# Altium project Programmable Power Supply.PrjPcb (part 1 of 2)
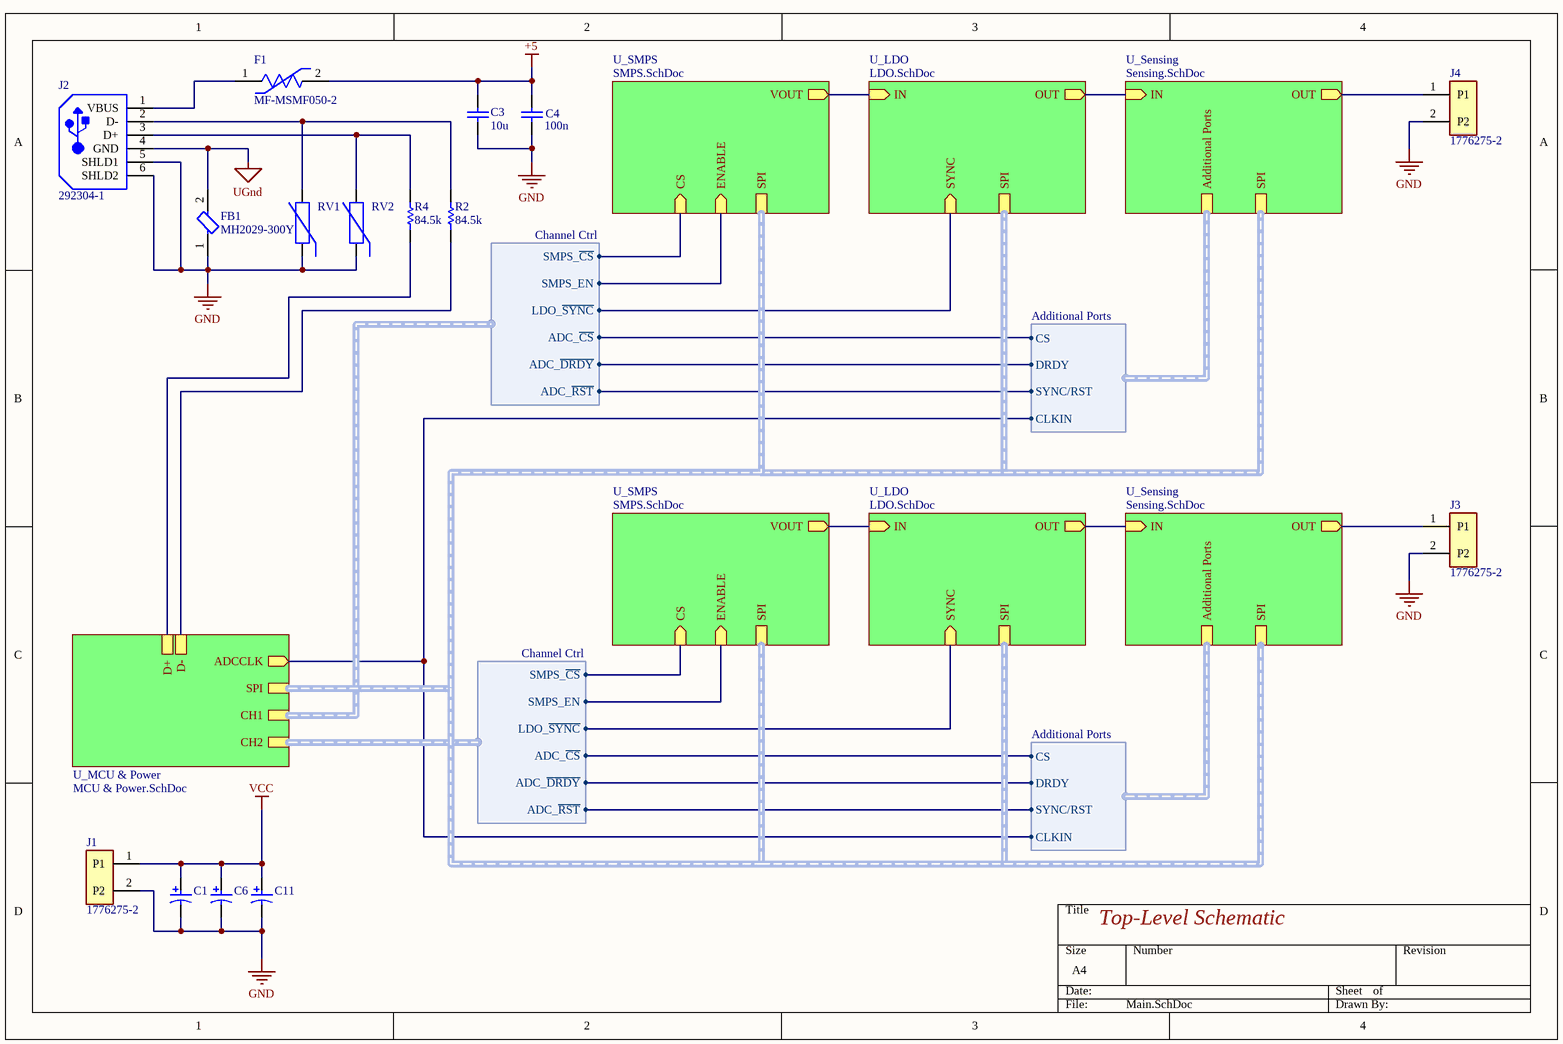
[diagram p0: Main.SchDoc]
5 sheets, 166 parts. Net scope: hierarchical (ports join the sheet entries above them; power ports are global).
Board file: PPS PCB.PcbDoc
Sheets:
  Main.SchDoc
    U_MCU & Power = MCU & Power.SchDoc
    U_SMPS = SMPS.SchDoc
    U_LDO = LDO.SchDoc
    U_Sensing = Sensing.SchDoc
    U_SMPS = SMPS.SchDoc
    U_LDO = LDO.SchDoc
    U_Sensing = Sensing.SchDoc

## Sheet Main.SchDoc
size A4; SheetNumber: 1; SheetTotal: 5

### Parts
C1  ECA-1JHG471  [CAPPR65-500-2000X1250X2200]  (value not drawn)
C3  10u  [CAPC3216X180X55LL20T30]
C4  100n  [CAPC2013X145X50LL20T25]
C6  ECA-1JHG471  [CAPPR65-500-2000X1250X2200]  (value not drawn)
C11  ECA-1JHG471  [CAPPR65-500-2000X1250X2200]  (value not drawn)
F1  MF-MSMF050-2  [FP-MF-MSMF050-2-MFG]
FB1  MH2029-300Y  [FP-MH2029-MFG]
J1  1776275-2  [TE_1776275-2]
J2  292304-1  [TECO-292304-1-4_V]
J3  1776275-2  [TE_1776275-2]
J4  1776275-2  [TE_1776275-2]
R2  84.5k  [RESC2013X60X35NL10T20]
R4  84.5k  [RESC2013X60X35NL10T20]
RV1  CG0603MLC-05E  [BOUR-CG0603-2_V]  (value not drawn)
RV2  CG0603MLC-05E  [BOUR-CG0603-2_V]  (value not drawn)

### Sub-sheets
U_LDO = LDO.SchDoc: IN (in), OUT (out), SPI (harness SPI Common), SYNC (in)
U_LDO = LDO.SchDoc: IN (in), OUT (out), SPI (harness SPI Common), SYNC (in)
U_MCU & Power = MCU & Power.SchDoc: ADCCLK (out), CH1 (harness Channel Ctrl), CH2 (harness Channel Ctrl), SPI (harness SPI Common), D-, D+
U_Sensing = Sensing.SchDoc: IN (in), OUT (out), Additional Ports (harness Additional Ports), SPI (harness SPI Common)
U_Sensing = Sensing.SchDoc: IN (in), OUT (out), Additional Ports (harness Additional Ports), SPI (harness SPI Common)
U_SMPS = SMPS.SchDoc: CS (in), ENABLE (in), VOUT (out), SPI (harness SPI Common)
U_SMPS = SMPS.SchDoc: CS (in), ENABLE (in), VOUT (out), SPI (harness SPI Common)

### Harnesses
Channel Ctrl: ADC_~{CS}, ADC_~{DRDY}, ADC_~{RST}, SMPS_~{CS}, SMPS_EN, LDO_~{SYNC}
Additional Ports: CLKIN, CS, DRDY, SYNC/RST

### Nets
+5: C3.2 C4.2 F1.2
GND: C1.2 C3.1 C4.1 C6.2 C11.2 FB1.1 J1.2(P2) J2.5(SHLD1) J2.6(SHLD2) J3.2(P2) J4.2(P2) RV1.1 RV2.1
UGnd: FB1.2 J2.4(GND)
VCC: C1.1 C6.1 C11.1 J1.1(P1)
NetC36_U_SMPS#1_2: sheet U_SMPS/VOUT, sheet U_LDO/IN
NetC36_U_SMPS#2_2: sheet U_SMPS/VOUT, sheet U_LDO/IN
NetC53_U_LDO#1_2: sheet U_LDO/OUT, sheet U_Sensing/IN
NetC53_U_LDO#2_2: sheet U_LDO/OUT, sheet U_Sensing/IN
NetF1_1: F1.1 J2.1(VBUS)
NetJ2_2: J2.2(D-) R2.2 RV1.2
NetJ2_3: J2.3(D+) R4.2 RV2.2
NetJ3_1: J3.1(P1) ; sheet U_Sensing/OUT
NetJ4_1: J4.1(P1) ; sheet U_Sensing/OUT
NetR2_1: R2.1 ; sheet U_MCU & Power/D-
NetR4_1: R4.1 ; sheet U_MCU & Power/D+
NetR16_U_SMPS#1_1: sheet U_SMPS/CS, sheet U_MCU & Power/CH1.SMPS_~{CS}
NetR16_U_SMPS#2_1: sheet U_SMPS/CS, sheet U_MCU & Power/CH2.SMPS_~{CS}
NetR21_U_SMPS#1_2: sheet U_SMPS/ENABLE, sheet U_MCU & Power/CH1.SMPS_EN
NetR21_U_SMPS#2_2: sheet U_SMPS/ENABLE, sheet U_MCU & Power/CH2.SMPS_EN
NetR24_U_LDO#1_1: sheet U_LDO/SYNC, sheet U_MCU & Power/CH1.LDO_~{SYNC}
NetR24_U_LDO#2_1: sheet U_LDO/SYNC, sheet U_MCU & Power/CH2.LDO_~{SYNC}
NetR29_U_Sensing#1_1: sheet U_MCU & Power/CH1.ADC_~{CS}, sheet U_Sensing/Additional Ports.CS
NetR29_U_Sensing#2_1: sheet U_MCU & Power/CH2.ADC_~{CS}, sheet U_Sensing/Additional Ports.CS
NetU1_26: sheet U_MCU & Power/CH1.ADC_~{RST}, sheet U_Sensing/Additional Ports.SYNC/RST
NetU1_27: sheet U_MCU & Power/CH1.ADC_~{DRDY}, sheet U_Sensing/Additional Ports.DRDY
NetU1_31: sheet U_MCU & Power/CH2.ADC_~{RST}, sheet U_Sensing/Additional Ports.SYNC/RST
NetU1_32: sheet U_MCU & Power/CH2.ADC_~{DRDY}, sheet U_Sensing/Additional Ports.DRDY
NetU2_2: sheet U_MCU & Power/ADCCLK, sheet U_Sensing/Additional Ports.CLKIN

### Buses and harness runs
harness sheet U_LDO/SPI = sheet U_MCU & Power/SPI = sheet U_Sensing/SPI = sheet U_SMPS/SPI

### Notes on the sheet
- Top-Level Schematic

### Library data of the parts
C1 C6 C11 = CMP-1665-00014-4: Aluminum Electrolytic Capacitor (Radial Lead Type), 470 uF, 63 V, -55 to 105 degC, 2-Pin THD, RoHS, Bulk; Manufacturer: Panasonic; Voltage Rating: 63 V; Lead Pitch: 5 mm; ComponentLink2URL: http://industrial.panasonic.com/cdbs/www-data/pdf/RDF0000/ABA0000C1038.pdf; DatasheetVersion: 03/2016; ComponentLink1URL: http://www.panasonic.com/; Mount: Through Hole; Max Operating Temperature: 105 degC; Pins: 2; Packaging: Bulk; ComponentLink1Description: Manufacturer URL; Height: 20 mm; REACH SVHC: No SVHC; RoHSCompliant: true; Mounting Technology: Through Hole; PackageDescription: 2-Pin Through Hole Device, Dia 12.5 mm, Body Length 20 mm; Package Quantity: 200; Min Operating Temperature: -55 degC; PackageReference: Radial; ComponentLink2Description: Datasheet; Length: 20 mm
C3 = CMP-2000-07261-1: High Value Multilayer Ceramic Capacitor, 10 uF, +/- 10%, 25 V, -55 to 125 degC, 1206 (3216 Metric), RoHS, Tape and Reel; Manufacturer: Taiyo Yuden; Catalog Drawings: xMKSeries_1206_1.6; Temperature Coefficient: X7R; Other Names: 587-2399-6; Capacitance: 10µF; Online Catalog: MSeries; Voltage - Rated: 25V; Package / Case: 1206(3216Metric); Thickness (Max): 0.071"(1.80mm); Tolerance: ±10%; Category: Capacitors; Size / Dimension: 0.126"Lx0.063"W(3.20mmx1.60mm); Lead Spacing: -; Standard Package: 1; Applications: GeneralPurpose; Features: -; Package Description: 2-Pin Surface Mount Device, Body 3.2 x 1.6 mm; Package Reference: 1206; Datasheet Version: 07/2015; Lead Style: -; Manufacturer URL: http://www.t-yuden.com/; Mounting Technology: SurfaceMount; Height - Seated (Max): -; Mounting Type: SurfaceMount,MLCC; Datasheet URL: http://datasheet.octopart.com/TMK316B7106KL-TD-Taiyo-Yuden-datasheet-62109620.pdf; Operating Temperature: -55°C~125°C; Series: M; Ratings: -; Packaging: Digi-Reel®; Family: CeramicCapacitors
C4 = CMP-2007-01136-1: Manufacturer: Kemet; Part Number: C0805C104K3RALTU
F1 = CMP-2100-03653-2: PTC RESET FUSE 15V 500MA 1812; Manufacturer: Bourns; Value: 0.15-1Ω; Trip Current: 1A; Automotive Grade: Grade 3; Trip Time: 0.15s; Current Rating: 100A; Hold Current: 0.5A; Height: 0.85mm; Package: 1812; Voltage Rating: 15V; Temperature Range High: +85°C; Device Class L2: PTC Resettable Fuses; Lead Free: Yes; ComponentLink2URL: http://www.bourns.com/docs/Product-Datasheets/mfmsmf.pdf; Ambient Temperature Range High: +85°C; Mouser Description: PTC Resettable Fuse 0.5A(hold) 1A(trip) 15V 100A 0.8W 0.15s 0.15Ohm SMD Solder Pad 1812 T/R; Digikey Description: PTC RESET FUSE 15V 500MA 1812; Manufacturer Part Number: MF-MSMF050-2; Resistance: 0.15-1Ω; Category: Fuse; ComponentLink2Description: Datasheet; Automotive: Yes; Temperature Range Low: -40°C; RoHS: TRUE; Device Class L1: Circuit Protection; Temperature: -40°C to +85°C; Octopart: https://octopart.com/mf-msmf050-2-bourns-28047; Ambient Temperature Range Low: -40°C; Device Class L3: unset
FB1 = CMP-07252-000001-1: FERRITE BEAD 30 OHM 0805 1LN; Manufacturer: Bourns; Series Resistance: 25mΩ; Resistance: 30Ω; Value: 30Ω; Impedance At Frequency: 30Ω @ 100MHz; Rms Current: 3A; Tolerance: 25%; RoHS: TRUE; Manufacturer Part Number: MH2029-300Y; Temperature Range High: +125°C; Device Class L3: Ferrite Beads and Chips; Core Material: Ferrite; ComponentLink2Description: Datasheet; Category: FBead; Octopart: https://octopart.com/mh2029-300y-bourns-756929; Digikey Description: FERRITE BEAD 30 OHM 0805 1LN; Device Class L2: EMI / RFI Components; Lead Free: Yes; Mouser Description: Ferrite Beads 30 ohms 25% HIGH CURRENT; Automotive: No; Ipc Land Pattern Name: CAPC200120X90; Temperature: -55°C to +125°C; Device Class L1: Passive Components; Height: 1.1mm; ComponentLink2URL: https://www.bourns.com/docs/Product-Datasheets/mh.pdf; Package: MH2029; Temperature Range Low: -55°C
J1 J3 J4 = 1776275-2: TERM BLOCK 2POS SIDE ENT 3.5MM; MF: {'manufacturer': u'TE Connectivity'}; Availability: Unavailable; Package: None; Price: None; Value: *; MP: 1776275-2
J2 = CMP-2000-05412-1: 1 Port Right Angle Through Hole Mount Female Type B USB Connector, 4 Position, -55 to 85 degC, RoHS, Tray; Manufacturer: TE Connectivity; USB Connector Type: USBTypeB; Gender: Receptacle; USB Standard: USB2.0; SVHC: ToBeAdvised; No. of Positions: 4; Series: B; Contact Plating: Gold; Orientation: RightAngle; Contact Material: CopperAlloy; Datasheet URL: https://datasheet.ciiva.com/851/eng-cd-292304-d2-851088.pdf; Connector Mounting: ThroughHole; Manufacturer URL: http://www.te.com/; Datasheet Version: Oct-93
R2 R4 = CMP-2001-01285-1: Manufacturer: Yageo; Part Number: RC0805FR-0784K5L
RV1 RV2 = CMP-0584-00001-2: ESD Protector, 5 V Supply, -40 to 85 degC, 1.6 x 0.8 x 0.55 mm SMD, RoHS, Tape and Reel; Manufacturer: Bourns; VC: 20 V; VT: 150 V; RT: 1 ns; VDC: 5 V; CO: 0.5 pF; PartNumber: CG0603MLC-05E; ComponentLink1Description: Manufacturer URL; ComponentLink1URL: http://www.bourns.com/; Packing: Tape and Reel; Mounting Technology: Surface Mount; ComponentLink2Description: Datasheet; RoHS: TRUE; Operating Temperature: -40 to 85 degC; DatasheetVersion: Rev. S; PackageDescription: 2-Pin SMD, Body 1.6 x 0.8 mm, Pitch 1.52 mm; PackageReference: CG0603-2; ComponentLink2URL: http://www.bourns.com/data/global/pdfs/MLC.pdf

## Sheet MCU & Power.SchDoc
size A4; SheetNumber: 5; SheetTotal: 5
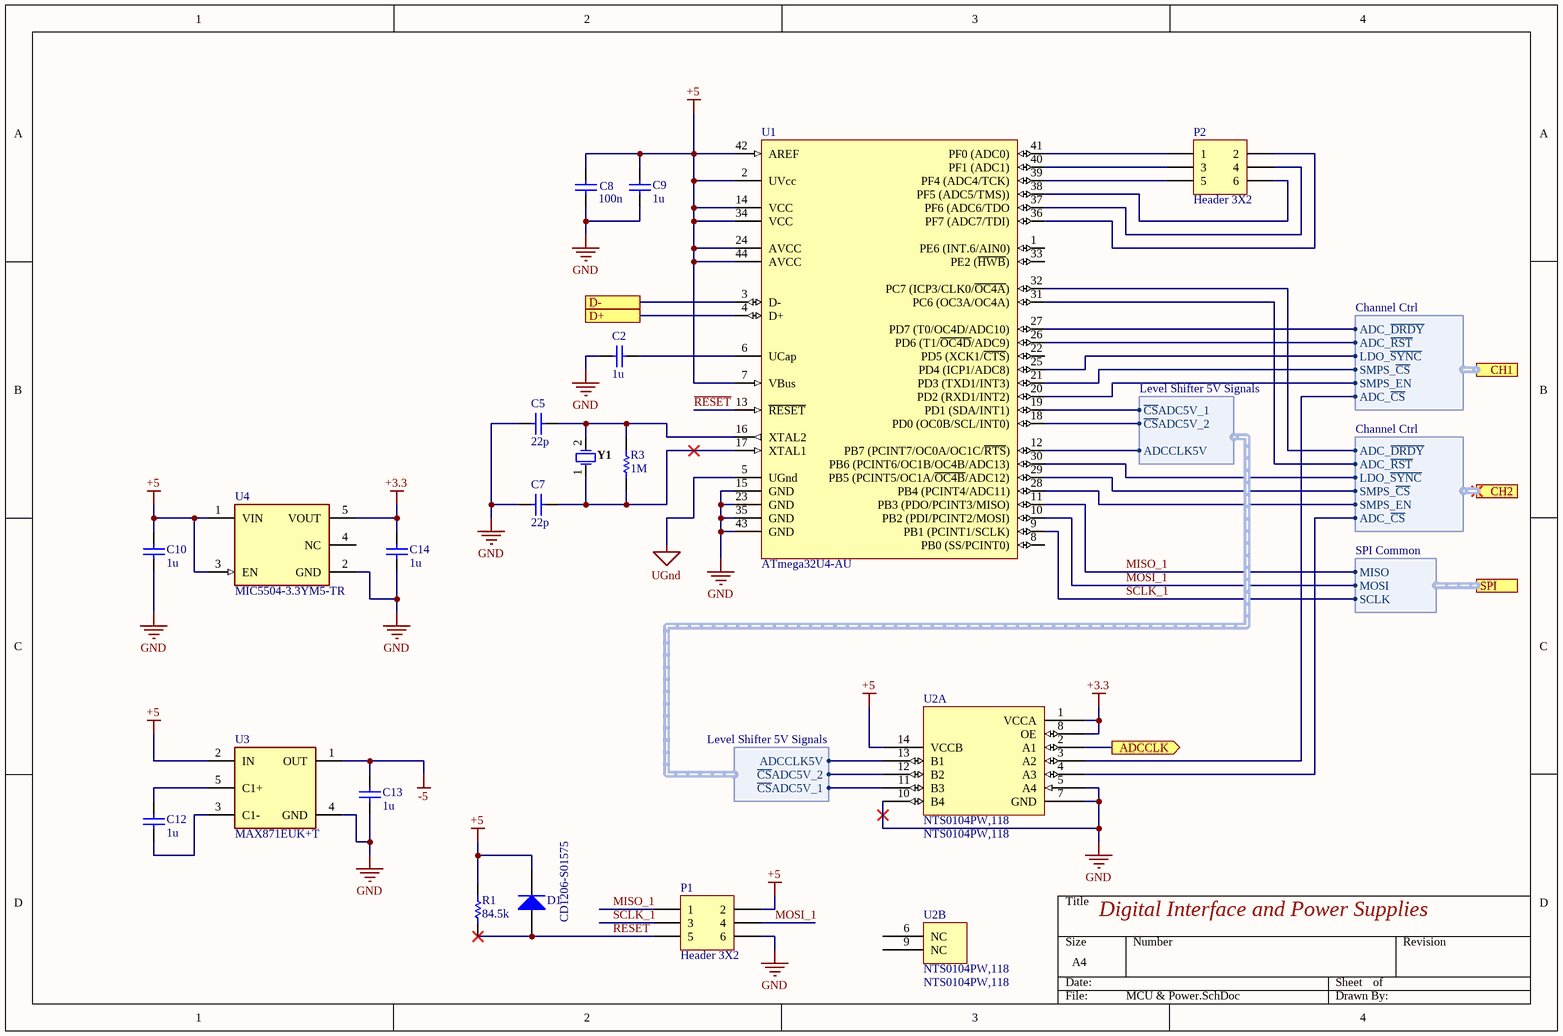
[diagram p1: MCU & Power.SchDoc]

### Parts
C2  1u  [CAPC2013X140X50LL20T25]
C5  22p  [CAPC2013X140X50NL20T25]
C7  22p  [CAPC2013X140X50NL20T25]
C8  100n  [CAPC2013X145X50LL20T25]
C9  1u  [CAPC2013X140X50LL20T25]
C10  1u  [CAPC2013X140X50LL20T25]
C12  1u  [CAPC2013X140X50LL20T25]
C13  1u  [CAPC2013X140X50LL20T25]
C14  1u  [CAPC2013X140X50LL20T25]
D1  CD1206-S01575  [BOUR-CD1206-S01575-2_N]
P1  Header 3X2  [HDR2X3]
P2  Header 3X2  [HDR2X3]
R1  84.5k  [RESC2013X60X35NL10T20]
R3  1M  [RESC2013X70X40NL20T20]
U1  ATmega32U4-AU  [44ML_M]
U2  NTS0104PW,118  [TSOP65P640X110-14N]  (parts A,B of 2)
U3  MAX871EUK+T  [FP-U5-2-MFG]
U4  MIC5504-3.3YM5-TR  [FP-SOT23-5LD-PL-1-MFG]
Y1  FOXSLF/160-20  [FOX-FOXSLF160-20]  (value not drawn)

### Ports
ADCCLK (out), CH1 (harness Channel Ctrl), CH2 (harness Channel Ctrl), D+, D-, SPI (harness SPI Common)

### Harnesses
Level Shifter 5V Signals: ~{CS}ADC5V_1, ~{CS}ADC5V_2, ADCCLK5V
Level Shifter 5V Signals: ADCCLK5V, ~{CS}ADC5V_1, ~{CS}ADC5V_2
Channel Ctrl: ADC_~{CS}, SMPS_EN, SMPS_~{CS}, LDO_~{SYNC}, ADC_~{RST}, ADC_~{DRDY}
SPI Common: MISO, MOSI, SCLK

### Nets
+3.3: C14.2 U2.1(VCCA) U2.8(OE) U4.5(VOUT)
+5: C8.2 C9.2 C10.2 D1.2(K) P1.2 R1.2 U1.2(UVcc) U1.7(VBus) U1.14(VCC) U1.24(AVCC) U1.34(VCC) U1.42(AREF) U1.44(AVCC) U2.14(VCCB) U3.2(IN) U4.1(VIN) U4.3(EN)
-5: C13.2 U3.1(OUT)
GND: C2.2 C5.1 C7.1 C8.1 C9.1 C10.1 C13.1 C14.1 P1.6 U1.15(GND) U1.23(GND) U1.35(GND) U1.43(GND) U2.5(A4) U2.7(GND) U2.10(B4) U3.4(GND) U4.2(GND)
UGnd: U1.5(UGnd)
MISO_1: P1.1 U1.11(PB3_(PDO/PCINT3/MISO)) ; port SPI.MISO
MOSI_1: P1.4 U1.10(PB2_(PDI/PCINT2/MOSI)) ; port SPI.MOSI
~{RESET}: D1.1(A) P1.5 R1.1 U1.13(~{RESET})
SCLK_1: P1.3 U1.9(PB1_(PCINT1/SCLK)) ; port SPI.SCLK
NetC2_1: C2.1 U1.6(UCap)
NetC5_2: C5.2 R3.2 U1.16(XTAL2) Y1.2
NetC7_2: C7.2 R3.1 U1.17(XTAL1) Y1.1
NetC12_1: C12.1 U3.3(C1-)
NetC12_2: C12.2 U3.5(C1+)
NetP2_1: P2.1 U1.41(PF0_(ADC0))
NetP2_2: P2.2 U1.36(PF7_(ADC7/TDI))
NetP2_3: P2.3 U1.40(PF1_(ADC1))
NetP2_4: P2.4 U1.37(PF6_(ADC6/TDO)
NetP2_5: P2.5 U1.39(PF4_(ADC4/TCK))
NetP2_6: P2.6 U1.38(PF5_(ADC5/TMS)))
NetR2_1: U1.3(D-) ; port D-
NetR4_1: U1.4(D+) ; port D+
NetR16_U_SMPS#1_1: U1.21(PD3_(TXD1/INT3)) ; port CH1.SMPS_~{CS}
NetR16_U_SMPS#2_1: U1.29(PB5_(PCINT5/OC1A/~{OC4B}/ADC12)) ; port CH2.SMPS_~{CS}
NetR21_U_SMPS#1_2: U1.20(PD2_(RXD1/INT2)) ; port CH1.SMPS_EN
NetR21_U_SMPS#2_2: U1.28(PB4_(PCINT4/ADC11)) ; port CH2.SMPS_EN
NetR24_U_LDO#1_1: U1.25(PD4_(ICP1/ADC8)) ; port CH1.LDO_~{SYNC}
NetR24_U_LDO#2_1: U1.30(PB6_(PCINT6/OC1B/OC4B/ADC13)) ; port CH2.LDO_~{SYNC}
NetR29_U_Sensing#1_1: U2.3(A2) ; port CH1.ADC_~{CS}
NetR29_U_Sensing#2_1: U2.4(A3) ; port CH2.ADC_~{CS}
NetU1_12: U1.12(PB7_(PCINT7/OC0A/OC1C/~{RTS})) U2.13(B1) ; harness Level Shifter 5V Signals.ADCCLK5V
NetU1_18: U1.18(PD0_(OC0B/SCL/INT0)) U2.12(B2) ; harness Level Shifter 5V Signals.~{CS}ADC5V_2
NetU1_19: U1.19(PD1_(SDA/INT1)) U2.11(B3) ; harness Level Shifter 5V Signals.~{CS}ADC5V_1
NetU1_26: U1.26(PD6_(T1/~{OC4D}/ADC9)) ; port CH1.ADC_~{RST}
NetU1_27: U1.27(PD7_(T0/OC4D/ADC10)) ; port CH1.ADC_~{DRDY}
NetU1_31: U1.31(PC6_(OC3A/OC4A)) ; port CH2.ADC_~{RST}
NetU1_32: U1.32(PC7_(ICP3/CLK0/~{OC4A})) ; port CH2.ADC_~{DRDY}
NetU2_2: U2.2(A1) ; port ADCCLK

Not connected (* = marked no-connect by the designer): U1 1(PE6_(INT.6/AIN0)) 8(PB0_(SS/PCINT0)) 22(PD5_(XCK1/~{CTS})) 33(PE2_(~{HWB})); U2 6(NC) 9(NC); U4 4(NC)

### Notes on the sheet
- Digital Interface and Power Supplies

### Library data of the parts
C2 C9 C10 C12-C14 = CMP-2007-03234-1: Part Number: C0805C105K3RACTU; Manufacturer: Kemet
C5 C7 = CMP-2007-04539-1: Part Number: 08051A220JAT2A; Manufacturer: AVX Interconnect / Elco
C8 = CMP-2007-01136-1: as C4 on sheet Main
D1 = CMP-0583-00001-2: 75 V Small Signal Switching Diode, 150 mA, 2.5 uA, 1026 Molded Package, RoHS, Tape and Reel; Manufacturer: Bourns; Reverse Voltage: 75 V; Average Forward Current: 150 mA; Reverse Current (Max.): 2.5 uA; Capacitance Between Terminals (Max.): 3 pF; Reverse Recovery Time (Max.): 4 nS; Forward Voltage (Max.): 1.00 V; Packing: Tape and Reel; Mounting Technology: Surface Mount; DatasheetVersion: Rev. 06/11; ComponentLink2URL: http://www.bourns.com/data/global/pdfs/CD1206_S01575.pdf; PackageReference: CD1206-S01575-2; RoHS: TRUE; ComponentLink1URL: http://www.bourns.com/; ComponentLink1Description: Manufacturer URL; ComponentLink3Description: Package Specification; ComponentLink3URL: http://www.bourns.com/data/global/pdfs/CD1206_S01575.pdf; ComponentLink2Description: Datasheet; PackageDescription: 2-Pin SMD, Body 3.2 x 1.5 mm; PartNumber: CD1206-S01575
P1 P2 = Header 3X2: Header, 3-Pin, Dual row; LatestRevisionDate: 17-Jul-2002; LatestRevisionNote: Re-released for DXP Platform.; Publisher: Altium Limited
R1 = CMP-2001-01285-1: as R2 on sheet Main
R3 = CMP-2001-00339-1: Part Number: ERJ-6GEYJ105V; Manufacturer: Panasonic
U1 = CMP-0095-00285-2: 8-bit AVR Microcontroller, 2.7-5.5V, 16MHz, 32KB Flash, 1KB EEPROM, 2.5KB SRAM, USB Controller, 44-pin TQFP, Industrial Grade (-40°C to 85°C), Ext Osc; RevisionNote: DatasheetVersion updated. URLs added.; ComponentLink1Description: Manufacturer URL; PackageDescription: 44-Pin Plastic Thin Quad Flat Pack, 10 x 10 x 1.0 mm Body, 0.8 mm Pitch (TQFP); DatasheetVersion: revF, Nov-2010; ComponentLink2URL: http://www.atmel.com/dyn/resources/prod_documents/doc7766.pdf; ComponentLink1URL: http://www.atmel.com/; PackageReference: 44ML; ComponentLink2Description: ATmega16U4/32U4 Datasheet; PackageVersion: rev.G, Jul-2007; ComponentLink3URL: http://www.atmel.com/dyn/resources/prod_documents/7766S.pdf; ComponentLink3Description: ATmega16U4 ATmega32U4 Summary
U2 = NTS0104PW,118: Voltage Level Translator 14-Pin TSSOP T/R; Manufacturer: NXP Semiconductors; Max Supply Voltage: 5.5V; Min Supply Voltage: 1.65V; High Level Output Current: -20uA; Low Level Output Current: 1mA; Quiescent Current: 45uA; Propagation Delay: 280ns; Data Rate: 50Mbps; Number of Channels: 4; Max Power Dissipation: 250mW; Turn-On Delay Time: 5.8ns; Number of Elements: 1; Polarity: Non-Inverting; Operating Frequency-Max: 10MHz; Supplier 1: Digi-Key; RoHS: Yes; Category: Voltage Level Shifters; Stock 1: 15992; Pricing 1: 1=0.89000, 10=0.79100, 25=0.75120, 100=0.72820 (USD); Mount: Surface Mount; Case/Package: TSSOP; Number of Pins: 14; Min Operating Temperature: -40°C; Max Operating Temperature: 125°C; Logic Function: Translator; Packaging: Tape and Reel; Package Quantity: 1; Number of Bits: 4; Output Type: Voltage; Series: -; Radiation Hardening: No; RoHS Compliant: Yes; Lead Free: Lead Free; ComponentLink1URL: https://datasheet.ciiva.com/15096/getdatasheetpartid-507519-15096327.pdf?src-supplier=Verical; ComponentLink1Description: https://datasheet.ciiva.com/15096/getdatasheetpartid-507519-15096327.pdf?src-supplier=Verical; ComponentLink2URL: https://datasheet.ciiva.com/1899/nts0104-1899064.pdf?src-supplier=Digi-Key; ComponentLink2Description: https://datasheet.ciiva.com/1899/nts0104-1899064.pdf?src-supplier=Digi-Key; ComponentLink3URL: https://datasheet.ciiva.com/1899/nts0104-1899065.pdf?src-supplier=Digi-Key; ComponentLink3Description: https://datasheet.ciiva.com/1899/nts0104-1899065.pdf?src-supplier=Digi-Key; ComponentLink4URL: https://datasheet.ciiva.com/1899/nts0104-1899066.pdf?src-supplier=Digi-Key; ComponentLink4Description: https://datasheet.ciiva.com/1899/nts0104-1899066.pdf?src-supplier=Digi-Key; ComponentLink5URL: https://datasheet.ciiva.com/8244/nts0104-8244175.pdf?src-supplier=Avnet; ComponentLink5Description: https://datasheet.ciiva.com/8244/nts0104-8244175.pdf?src-supplier=Avnet; Manufacturer Part Number: NTS0104PW,118
U3 = CMP-05722-000155-1: IC REG CHRG PUMP LCD 1OUT SOT23; Manufacturer: Maxim; Nominal Supply Current: 2.7mA; Number Of Outputs: 1; Min Supply Voltage: 1V; Switching Frequency: 500kHz; Max Supply Voltage: 5.5V; Max Power Dissipation: 571mW; Switching Topology: Charge Pump; Output Type: Fixed; Negative Voltage Available: true; Standoff Height: 0mm; Output Voltage: -5.5V; Output Current: 25mA; Temperature: -40°C to +85°C; Lead Free: Yes; Footprint Url: https://pdfserv.maximintegrated.com/land_patterns/90-0174.PDF; Digikey Description: IC REG CHRG PUMP LCD 1OUT SOT23; Octopart: https://octopart.com/max871euk%2Bt-maxim+integrated-39868455; Device Class L1: Integrated Circuits (ICs); Automotive: No; ComponentLink2Description: Datasheet; Device Class L2: Power Management ICs; Category: IC; Temperature Range Low: -40°C; RoHS: TRUE; ComponentLink2URL: https://datasheets.maximintegrated.com/en/ds/MAX870-MAX871.pdf; Temperature Range High: +85°C; Height: 1.45mm; Package: U5-2; Device Class L3: Voltage Regulators - Switching; Manufacturer Part Number: MAX871EUK+T
U4 = CMP-2000-07604-2: IC REG LINEAR 3.3V 300MA SOT23-5; Quiescent Current: 38uA; Operating Supply Current: 42uA; Max Input Voltage: 5.5V; Min Input Voltage: 2.5V; Output Type: Fixed; Power Supply Rejection Ratio (PSRR): 60dB; Dropout Voltage: 380mV; Accuracy: 3%; Number of Outputs: 1; Nominal Output Voltage: 3.3V; Max Output Current: 300mA; Length: 2.9mm; Mount: Surface Mount; Width: 1.6mm; Packaging: Tape and Reel; Output Current: 300mA; Min Operating Temperature: -40°C; Max Operating Temperature: 125°C; Height: 1.1mm; Case/Package: SOT-23-5; REACH SVHC: No SVHC; Number of Pins: 5; Output Voltage: 3.3V
Y1 = CMP-1749-00003-1: Resistance Weld Thru-Hole Crystal, 16 MHz, -20 to 70 degC, 2-Pin THD, RoHS, Bulk; Voltage Rating: 250 V; Tolerance: 1%; Resistance: 221 kohm; Case\Package: Axial; Power Rating: 250 mW; RoHSCompliant: true; Package Quantity: 200; Packaging: Bulk; Min Operating Temperature: -55 degC; DatasheetVersion: Mar-15; ComponentLink1URL: http://www.foxonline.com/; Max Operating Temperature: 155 degC; PackageReference: FOXSLF160-20; Mount: Through Hole; PackageDescription: 2-Pin Through Hole Device, Body 11.35 x 4.65 mm; ComponentLink1Description: Manufacturer URL; ComponentLink2URL: http://www.foxonline.com/pdfs/hc49slf.pdf; ComponentLink2Description: Datasheet; Length: 0.248 inch

## Sheet SMPS.SchDoc
size A4; SheetNumber: 2; SheetTotal: 5
Used 2 times, as channels U_SMPS, U_SMPS. Parts and nets are listed once, with the designators drawn on the sheet.
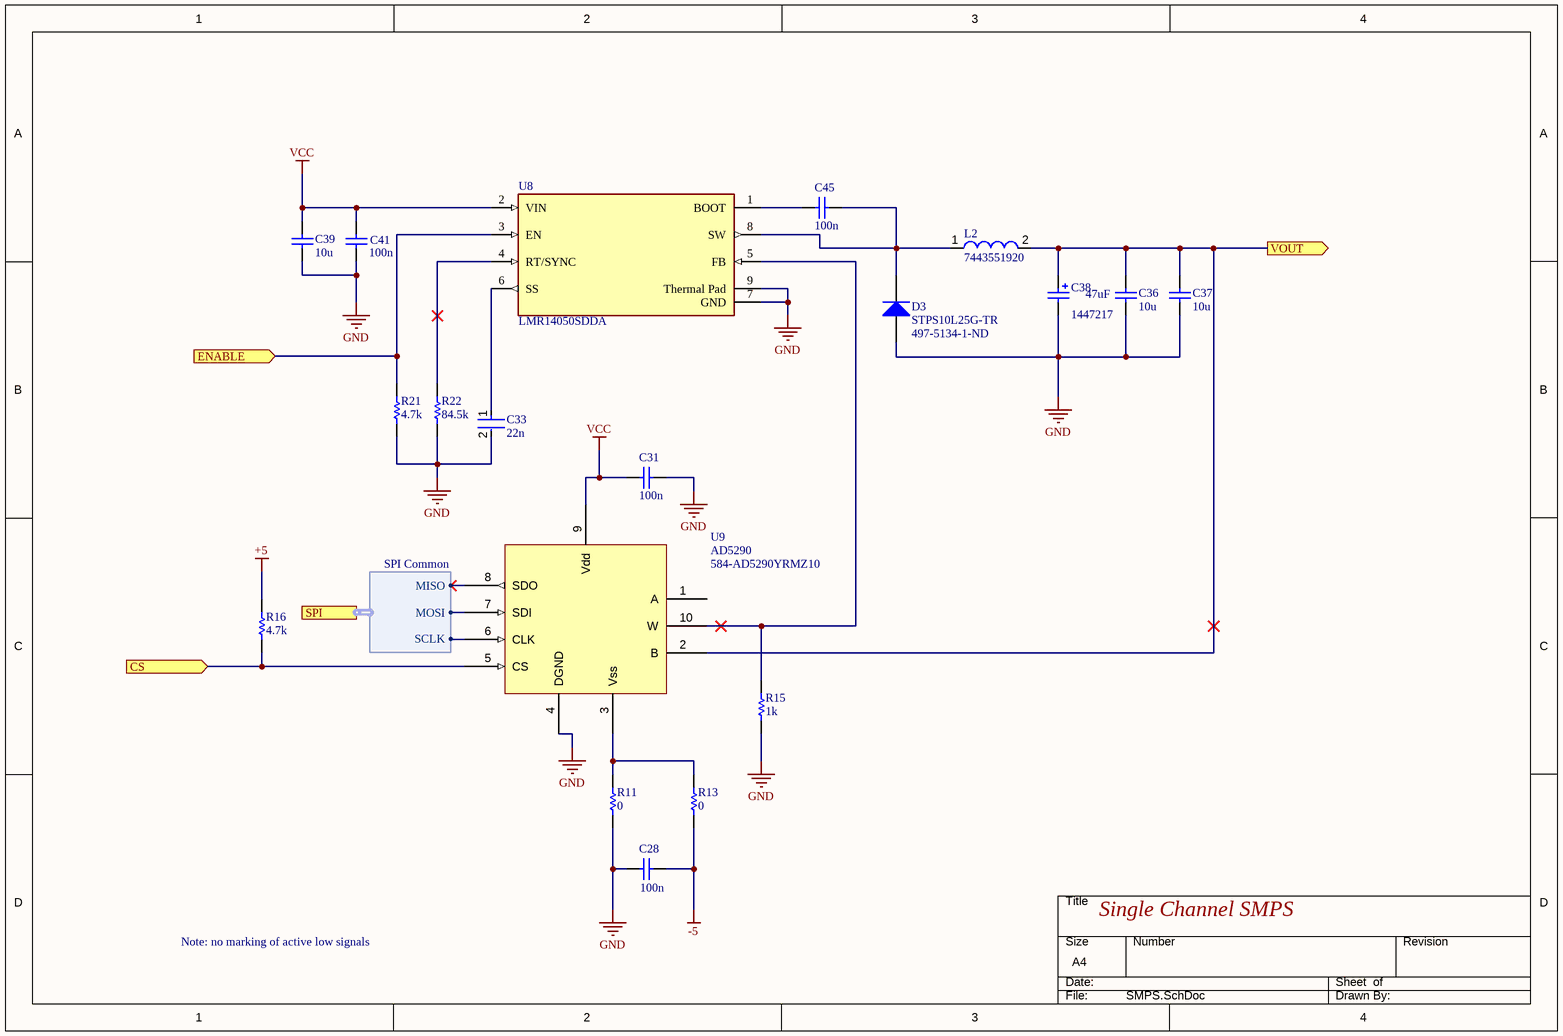
[diagram p2: SMPS.SchDoc]

### Parts
C28  100n  [CAPC2013X145X50LL20T25]
C31  100n  [CAPC2013X145X50NL20T25]
C33  22n  [FP-CC0805-0_85-MFG]
C36  10u  [CAPC3216X180X55LL20T30]
C37  10u  [CAPC3216X180X55LL20T30]
C38  Capacitance: 47uF  Supplier Part Number 1: 1447217  [7343]  (hidden comment: T521X476M035ATE030)
C39  10u  [CAPC3216X180X55LL20T30]
C41  100n  [CAPC2013X145X50LL20T25]
C45  100n  [CAPC2013X145X50LL20T25]
D3  STPS10L25G-TR  Supplier Part Number 1: 497-5134-1-ND  [D2PAK]
L2  7443551920  [WE-HCI-1365]
R11  0  [RESC2013X70X40NL20T20]
R13  0  [RESC2013X70X40NL20T20]
R15  1k  [RESC2013X50X30NL20T20]
R16  4.7k  [RESC2013X70X40ML20T20]
R21  4.7k  [RESC2013X70X40NL20T20]
R22  84.5k  [RESC2013X60X35NL10T20]
U8  LMR14050SDDA  [FP-DDA0008E-IPC_B]
U9  AD5290  Supplier Part Number 1: 584-AD5290YRMZ10  [MSOP10]

### Ports
CS (in), ENABLE (in), SPI (harness SPI Common), VOUT (out)

### Harnesses
SPI Common: MISO, MOSI, SCLK

### Nets
+5: R16.2
-5: C28.1 R13.1
GND: C28.2 C31.1 C33.2 C36.1 C37.1 C38.2 C39.1 C41.1 D3.1(A) R11.1 R15.1 R21.1 R22.1 U8.7(GND) U8.9(Thermal_Pad) U9.4(DGND)
VCC: C31.2 C39.2 C41.2 U8.2(VIN) U9.9(Vdd)
CS: R16.1 U9.5(CS) ; port CS
ENABLE: R21.2 U8.3(EN) ; port ENABLE
VOUT: C36.2 C37.2 C38.1 L2.2 U9.2(B) ; port VOUT
NetC33_1: C33.1 U8.6(SS)
NetC45_1: C45.1 D3.2(K) L2.1 U8.8(SW)
NetC45_2: C45.2 U8.1(BOOT)
NetR11_2: R11.2 R13.2 U9.3(Vss)
NetR15_2: R15.2 U8.5(FB) U9.10(W)
NetR22_2: R22.2 U8.4(RT/SYNC)
NetU9_6: U9.6(CLK) ; port SPI.SCLK
NetU9_7: U9.7(SDI) ; port SPI.MOSI
NetU9_8: U9.8(SDO) ; port SPI.MISO

Not connected (* = marked no-connect by the designer): U9 1(A)

### Channels
U_SMPS: designators end in _U_SMPS#1; ports CS=NetR16_U_SMPS#1_1 ENABLE=NetR21_U_SMPS#1_2 VOUT=NetC36_U_SMPS#1_2
U_SMPS: designators end in _U_SMPS#2; ports CS=NetR16_U_SMPS#2_1 ENABLE=NetR21_U_SMPS#2_2 VOUT=NetC36_U_SMPS#2_2

### Notes on the sheet
- Single Channel SMPS
- Note: no marking of active low signals
- THIS DOCUMENT AND THE DATA DISCLOSED HEREIN OR
- HEREWITH IS THE PROPERTY OF ALTIUM LIMITED AND MAY
- DWG NO:
- REVISION
- REV:
- DESCRIPTION
- DATE
- APPROVED
- BE FREELY DISTRIBUTED IN WHOLE. NO RIGHTS ARE
- RESERVED OR EXPRESS OR IMPLIED WARANTEE GIVEN.
- ENG:
- APPROVALS
- PROJECT
- DSN:
- CHK:
- REFERENCE DOCUMENTS
- PROJECT REVISION:
- TITLE
- DOCUMENT REVISION:
- DESIGN ITEM:
- BOM:
- FAB DWG:
- PCB DWG:
- ASSY DWG:
- SCALE:
- A3
- SIZE
- CAGE CODE
- FILE NAME
- DWG NO.
- SHEET
- OF
- REV

### Library data of the parts
C28 C31 C41 C45 = CMP-2007-01136-1: as C4 on sheet Main
C33 = CMP-1036-04052-2: CAP CER 0.022UF 25V X7R 0805; Manufacturer Part Number: CC0805KRX7R8BB223; Manufacturer: Yageo; Capacitance: 22 nF; Tolerance: 0.1; Material: Ceramic; Value: 22 nF; Automotive: No; ComponentLink2Description: Datasheet; Ipc Land Pattern Name: CAPC200125X85; Height: 0.95mm; Temperature Characteristic: X7R; Lead Free: Yes; Footprint Url: http://www.yageo.com/exep/pages/download/literatures/UPY-C_GEN_24.pdf; ComponentLink2URL: http://www.yageo.com/documents/recent/UPY-GPHC_Y5V_6.3V-to-50V_8.pdf; Octopart: https://octopart.com/cc0805krx7r8bb223-yageo-42522869; Category: Cap; Package: CC0805-0.85; Digikey Description: CAP CER 0.022UF 25V X7R 0805; Temperature Range High: +85°C; Temperature: -30°C to +85°C; Voltage Rating: 25 V; Device Class L3: Ceramic Capacitors; Device Class L1: Passive Components; Device Class L2: Capacitors; RoHS: TRUE; Mouser Description: Multilayer Ceramic Capacitors MLCC - SMD/SMT 22nF 25V X7R 10%; Temperature Range Low: -30°C
C36 C37 C39 = CMP-2000-07261-1: as C3 on sheet Main; Package / Case: 1206(3216Metric); Thickness (Max): 0.071"(1.80mm); Tolerance: ±10%; Category: Capacitors; Size / Dimension: 0.126"Lx0.063"W(3.20mmx1.60mm); Lead Spacing: -; Standard Package: 1; Applications: GeneralPurpose; Features: -; Package Description: 2-Pin Surface Mount Device, Body 3.2 x 1.6 mm; Package Reference: 1206; Datasheet Version: 07/2015; Lead Style: -; Manufacturer URL: http://www.t-yuden.com/; Mounting Technology: SurfaceMount; Height - Seated (Max): -; Mounting Type: SurfaceMount,MLCC; Datasheet URL: http://datasheet.octopart.com/TMK316B7106KL-TD-Taiyo-Yuden-datasheet-62109620.pdf; Operating Temperature: -55°C~125°C; Series: M; Ratings: -; Packaging: Digi-Reel®; Family: CeramicCapacitors
C38 = T521X476M035ATE030: KEMET - T521X476M035ATE030 - CAP, TANT, POLYMER, 47UF, 35V, CASE X; pin to pad: 1>2 2>1; Tolerance: 20%; ESR (Equivalent Series Resistance): 30mR; Polarity: Polar; Life (Hours): 2000Hour; Dissipation Factor: 10%; Supplier 1: RSComponents; Manufacturer: KEMET; Manufacturer Part Number: T521X476M035ATE030; RoHS: Yes; Category: Polymer Capacitors; Stock 1: 1; Pricing 1: 500=2.79100, 1500=2.59300 (USD); Mount: Surface Mount; Case/Package: 2917; Number of Pins: 2; Case Code (Imperial): 2917; Case Code (Metric): 7343; Min Operating Temperature: -55°C; Max Operating Temperature: 125°C; Voltage Rating: 35V; Packaging: Tape and Reel; Package Quantity: 1; Voltage Rating (DC): 35V; Termination: SMD/SMT; Features: General Purpose; Series: KO-CAP T521; Construction: Flat; Length: 7.3mm; Width: 4.3mm; Height: 4mm; Height - Seated (Max): 0.169inch; Depth: 4.3mm; RoHS Compliant: Yes; REACH SVHC: No SVHC; ComponentLink1URL: https://datasheet.ciiva.com/7759/1056102-7759041.pdf?src-supplier=Element14; ComponentLink1Description: https://datasheet.ciiva.com/7759/1056102-7759041.pdf?src-supplier=Element14; ComponentLink2URL: https://datasheet.ciiva.com/262/kem-t2016-t521-262925.pdf?src-supplier=Digi-Key; ComponentLink2Description: https://datasheet.ciiva.com/262/kem-t2016-t521-262925.pdf?src-supplier=Digi-Key; ComponentLink3URL: https://datasheet.ciiva.com/262/kem-t2016-t521-262927.pdf?src-supplier=Digi-Key; ComponentLink3Description: https://datasheet.ciiva.com/262/kem-t2016-t521-262927.pdf?src-supplier=Digi-Key; ComponentLink4URL: https://datasheet.ciiva.com/22698/1899432-22698968.pdf?src-supplier=Element14; ComponentLink4Description: https://datasheet.ciiva.com/22698/1899432-22698968.pdf?src-supplier=Element14; ComponentLink5URL: https://datasheet.ciiva.com/262/kem-t2016-t521-262926.pdf?src-supplier=Digi-Key; ComponentLink5Description: https://datasheet.ciiva.com/262/kem-t2016-t521-262926.pdf?src-supplier=Digi-Key
D3 = STPS10L25G-TR: STMICROELECTRONICS   STPS10L25G-TR   DIODE, SCHOTTKY, 10A, 25V, DPAK; pin to pad: 1>3 2>4; Max Reverse Current: 800uA; Peak Non-Repetitive Surge Current: 200A; Element Configuration: Single; Forward Voltage: 550mV; Polarity: Standard; Supplier 1: Digi-Key; Manufacturer: STMicroelectronics; Manufacturer Part Number: STPS10L25G-TR; RoHS: Yes; Category: Rectifier Diodes; Stock 1: 1023; Pricing 1: 1=2.11000, 10=1.89200, 100=1.52080, 500=1.24952 (USD); Mount: Surface Mount; Case/Package: D2PAK; Number of Pins: 3; Min Operating Temperature: -65°C; Max Operating Temperature: 150°C; Forward Current: 10A; Max Repetitive Reverse Voltage (Vrrm): 25V; Max Surge Current: 200A; Package Quantity: 1; Packaging: Tape and Reel; Max Reverse Leakage Current: 800uA; Average Rectified Current: 10A; Max Forward Surge Current (Ifsm): 200A; Voltage Rating (DC): 25V; Current Rating: 10A; Output Current: 10A; Max Reverse Voltage (DC): 25V; Series: -; Radiation Hardening: No; REACH SVHC: No SVHC; Lead Free: Lead Free; RoHS Compliant: Yes; ComponentLink1URL: https://datasheet.ciiva.com/916/cd00000842-916425.pdf?src-supplier=Digi-Key; ComponentLink1Description: https://datasheet.ciiva.com/916/cd00000842-916425.pdf?src-supplier=Digi-Key; ComponentLink2URL: https://datasheet.ciiva.com/916/cd00000842-916426.pdf?src-supplier=Digi-Key; ComponentLink2Description: https://datasheet.ciiva.com/916/cd00000842-916426.pdf?src-supplier=Digi-Key; ComponentLink3URL: https://datasheet.ciiva.com/916/cd00000842-916427.pdf?src-supplier=Digi-Key; ComponentLink3Description: https://datasheet.ciiva.com/916/cd00000842-916427.pdf?src-supplier=Digi-Key; ComponentLink4URL: https://datasheet.ciiva.com/16289/cd00000842-16289051.pdf?src-supplier=Future+Electronics; ComponentLink4Description: https://datasheet.ciiva.com/16289/cd00000842-16289051.pdf?src-supplier=Future+Electronics
L2 = CMP-0226-00027-1: SMD Flat Wire High Current Inductor WE-HCI, L=9.20 µH; Inductance: 9.20 ÂµH; PackageVersion: 2008; ComponentLink2URL: http://www.we-online.de/katalog/media/pdf/7443551920.pdf; ComponentLink1URL: http://www.we-online.com; PackageReference: WE-HCI-1365; DatasheetVersion: ver 4, Jan-2008; ComponentLink1Description: Manufacturer Link; PackageDescription: Inductor, 2-Leads, Body 13.2 x 12.8 mm; ComponentLink2Description: Datasheet
R11 R13 = CMP-1665-00002-5: Chip Resistor, 0 Ohm, +/- 1%, 0.125 W, -55 to 155 degC, 0805 (2012 Metric), RoHS, Tape and Reel; PartNumber: ERJ-6GEY0R00V; Tolerance: 5%; Resistance: 0 Ohm; REACH SVHC: No SVHC; Min Operating Temperature: -55 degC; Case/Package: 0805; Packaging: Tape and Reel; Package Quantity: 5000; ComponentLink1Description: Manufacturer URL; PackageDescription: 2-Pin Surface Mount Device, Body 2 x 1.25 mm; Mounting Technology: Surface Mount; Max Operating Temperature: 155 degC; Width: 1.25 mm; RoHSCompliant: True; Height: 0.6 mm; ComponentLink1URL: http://www.panasonic.com/; ComponentLink2URL: http://industrial.panasonic.com/cdbs/www-data/pdf/RDA0000/AOA0000C84.pdf; Case Code (Imperial): 0805; DatasheetVersion: 03/2015; Length: 2 mm; Case Code (Metric): 2012; ComponentLink2Description: Datasheet; Radiation Hardening: No
R15 = CMP-1013-00510-2: Part Number: CRCW08051K00FKEA; Manufacturer: Vishay Dale
R16 R21 = CMP-2001-00420-1: Manufacturer: Panasonic; Part Number: ERJ-6GEYJ472V
R22 = CMP-2001-01285-1: as R2 on sheet Main
U8 = CMP-04918-000310-1: IC REG BUCK ADJUSTABLE 5A 8SOPWR; Max Input Voltage: 40V; Quiescent Current: 40uA; Switching Frequency: 2.5MHz; Output Configuration: Positive; Max Output Voltage: 28V; Min Output Voltage: 800mV; Number of Outputs: 1; Synchronous Rectifier: No; Min Input Voltage: 4V; Output Current: 5A; Lead Free: Lead Free; Case/Package: SOIC; Min Operating Temperature: -40°C; Number of Pins: 8; Max Operating Temperature: 125°C; Packaging: Rail/Tube; RoHS Compliant: Yes; REACH SVHC: No SVHC; Output Type: Adjustable; Output Voltage: 28V; Mount: Surface Mount
U9 = AD5290: DIGIPOT 8BIT 10K, SMD, 5290, MSOP10; Manufacturer: Analog Devices; Manufacturer Part Number: AD5290YRMZ10; Resistance: 10kR; Memory Type: Volatile; Number of Positions: 256; Min Supply Voltage: 20V; Max Supply Voltage: 30V; Interface: SPI; Number of Elements: 1; Tolerance: 30%; Nominal Supply Current: 15uA; Min Dual Supply Voltage: 10V; Max Dual Supply Voltage: 15V; Temperature Coefficient: 35ppm/°C; Frequency: 4MHz; -3db Bandwidth: 470Hz; Voltage: 35V; Supplier 1: Mouser; RoHS: Yes; Category: Digital Potentiometers; Stock 1: 49; Pricing 1: 1=5.81000, 10=4.94000, 50=4.79000, 100=4.27000, 1000=4.05000, 10000=4.05000 (USD); Mount: Surface Mount; Case/Package: MSOP; Number of Pins: 10; Contact Plating: Tin,Matte; Min Operating Temperature: -40°C; Max Operating Temperature: 125°C; Packaging: Rail/Tube; Package Quantity: 50; Series: -; Taper: Linear; Number of Circuits: 1; Number of Taps: 256; Operating Supply Current: 15uA; Max Supply Current: 15uA; Supply Current: 15uA; Resistance Tolerance: 30%; Length: 3mm; Width: 3mm; Height: 0.85mm; Radiation Hardening: No; Lead Free: Contains Lead; RoHS Compliant: Yes; REACH SVHC: No SVHC; ComponentLink1URL: https://datasheet.ciiva.com/1145/1519523-1145622.pdf?src-supplier=Element14; ComponentLink1Description: https://datasheet.ciiva.com/1145/1519523-1145622.pdf?src-supplier=Element14; ComponentLink2URL: https://datasheet.ciiva.com/16471/ad5290-16471686.pdf?src-supplier=Avnet+Asia; ComponentLink2Description: https://datasheet.ciiva.com/16471/ad5290-16471686.pdf?src-supplier=Avnet+Asia; ComponentLink3URL: https://datasheet.ciiva.com/1331/ad5290-1331012.pdf?src-supplier=Digi-Key; ComponentLink3Description: https://datasheet.ciiva.com/1331/ad5290-1331012.pdf?src-supplier=Digi-Key; ComponentLink4URL: https://datasheet.ciiva.com/25918/ad5290-25918522.pdf?src-supplier=Avnet+Europe; ComponentLink4Description: https://datasheet.ciiva.com/25918/ad5290-25918522.pdf?src-supplier=Avnet+Europe; ComponentLink5URL: https://datasheet.ciiva.com/3045/ad5290-3045389.pdf?src-supplier=Avnet; ComponentLink5Description: https://datasheet.ciiva.com/3045/ad5290-3045389.pdf?src-supplier=Avnet

## Sheet LDO.SchDoc
size A4; SheetNumber: 3; SheetTotal: 5
Used 2 times, as channels U_LDO, U_LDO. Parts and nets are listed once, with the designators drawn on the sheet.
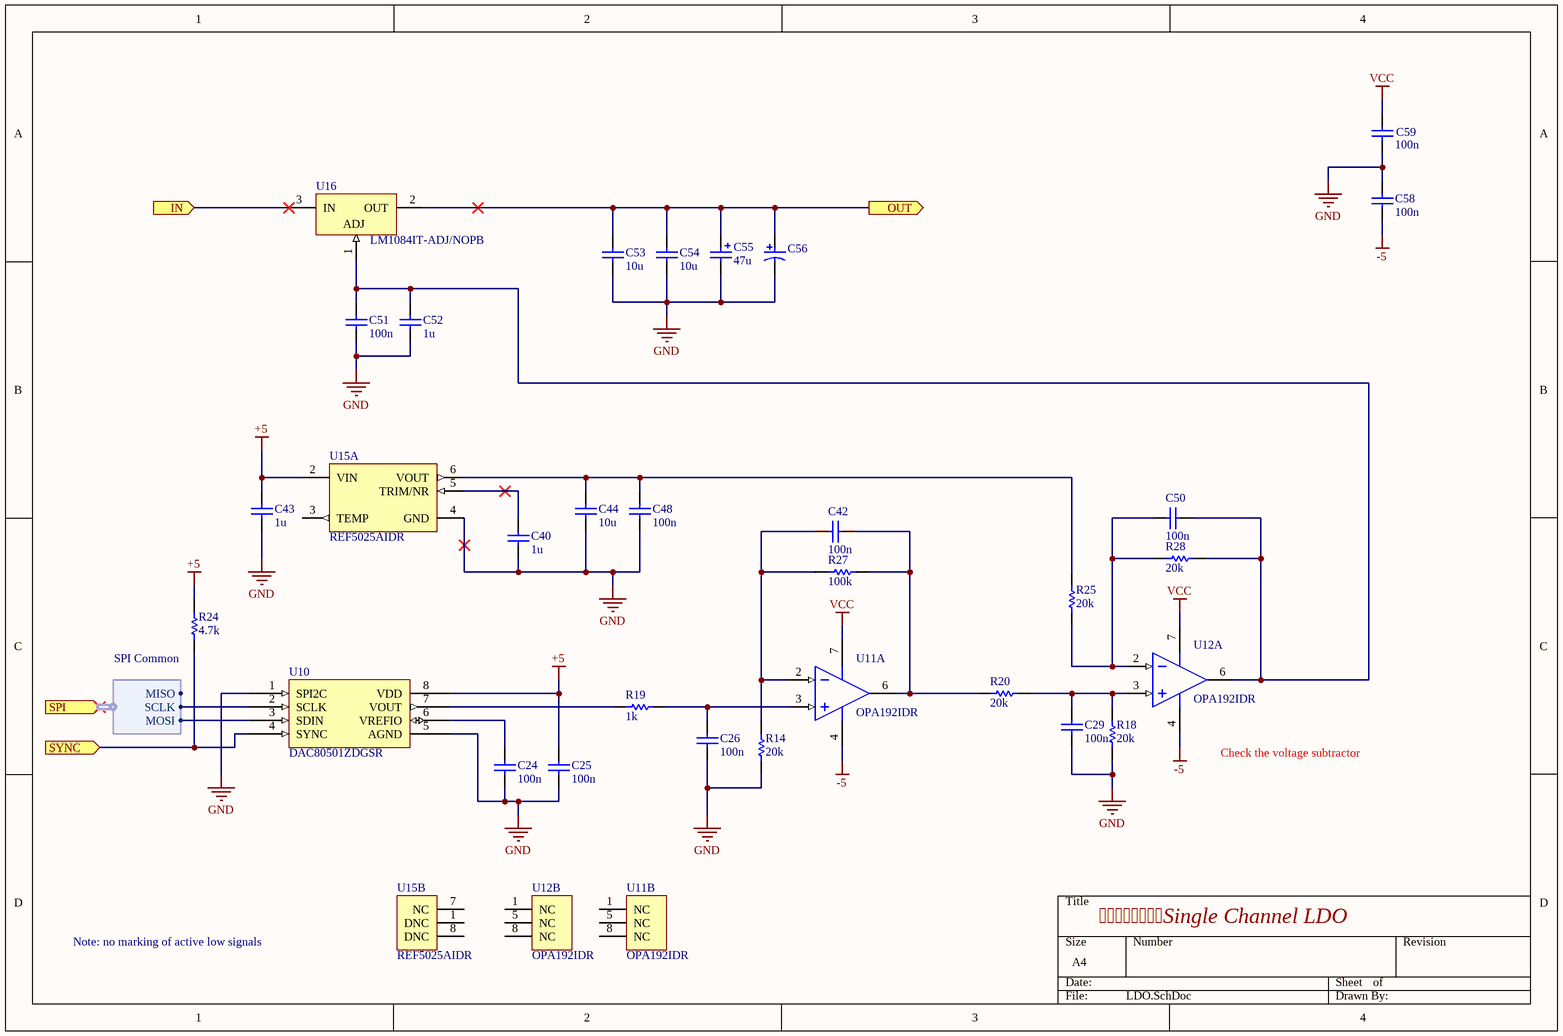
[diagram p3: LDO.SchDoc]

### Parts
C24  100n  [CAPC2013X145X50LL20T25]
C25  100n  [CAPC2013X145X50LL20T25]
C26  100n  [CAPC2013X145X50NL20T25]
C29  100n  [CAPC2013X145X50NL20T25]
C40  1u  [CAPC2013X140X50LL20T25]
C42  100n  [CAPC2013X145X50NL20T25]
C43  1u  [CAPC2013X140X50LL20T25]
C44  10u  [CAPC3216X180X55LL20T30]
C48  100n  [CAPC2013X145X50LL20T25]
C50  100n  [CAPC2013X145X50NL20T25]
C51  100n  [CAPC2013X145X50LL20T25]
C52  1u  [CAPC2013X140X50LL20T25]
C53  10u  [CAPC3216X180X55LL20T30]
C54  10u  [CAPC3216X180X55LL20T30]
C55  47u  [7343]
C56  ECA-1JHG471  [CAPPR65-500-2000X1250X2200]  (value not drawn)
C58  100n  [CAPC2013X145X50LL20T25]
C59  100n  [CAPC2013X145X50LL20T25]
R14  20k  [RESC2013X70X40NL20T20]
R18  20k  [RESC2013X70X40NL20T20]
R19  1k  [RESC2013X50X30NL20T20]
R20  20k  [RESC2013X70X40NL20T20]
R24  4.7k  [RESC2013X70X40NL20T20]
R25  20k  [RESC2013X70X40NL20T20]
R27  100k  [RESC2013X70X40NL20T20]
R28  20k  [RESC2013X70X40NL20T20]
U10  DAC80501ZDGSR  [MSOP10]
U11  OPA192IDR  [D0008A_M]  (parts A,B of 2)
U12  OPA192IDR  [D0008A_M]  (parts A,B of 2)
U15  REF5025AIDR  [D0008A_L]  (parts A,B of 2)
U16  LM1084IT-ADJ/NOPB  [NDE0003A]

### Ports
IN (in), OUT (out), SPI (in, harness SPI Common), SYNC (in)

### Harnesses
SPI Common: MISO, MOSI, SCLK

### Nets
+5: C25.1 C43.2 R24.2 U10.8(VDD) U15.2(VIN)
-5: C58.2 U11.4(V-) U12.4(V-)
GND: C24.2 C25.2 C26.2 C29.2 C40.1 C43.1 C44.1 C48.2 C51.2 C52.1 C53.1 C54.1 C55.2 C56.2 C58.1 C59.2 R14.1 R18.1 U10.1(SPI2C) U10.5(AGND) U15.4(GND)
VCC: C59.1 U11.7(V+) U12.7(V+)
IN: U16.3(IN) ; port IN
OUT: C53.2 C54.2 C55.1 C56.1 U16.2(OUT) ; port OUT
SYNC: R24.1 U10.4(SYNC) ; port SYNC
NetC24_1: C24.1 U10.6(VREFIO)
NetC26_1: C26.1 R19.1 U11.3(IN+)
NetC29_1: C29.1 R18.2 R20.2 U12.3(IN+)
NetC40_2: C40.2 U15.5(TRIM/NR)
NetC42_1: C42.1 R20.1 R27.2 U11.6(OUT)
NetC42_2: C42.2 R14.2 R27.1 U11.2(IN-)
NetC44_2: C44.2 C48.1 R25.2 U15.6(VOUT)
NetC50_1: C50.1 C51.1 C52.2 R28.1 U12.6(OUT) U16.1(ADJ)
NetC50_2: C50.2 R25.1 R28.2 U12.2(IN-)
NetR19_2: R19.2 U10.7(VOUT)
NetU10_2: U10.2(SCLK) ; port SPI.SCLK
NetU10_3: U10.3(SDIN) ; port SPI.MOSI

Not connected (* = marked no-connect by the designer): U11 1(NC) 5(NC) 8(NC); U12 1(NC) 5(NC) 8(NC); U15 1(DNC) 3(TEMP) 7(NC) 8(DNC)

### Channels
U_LDO: designators end in _U_LDO#1; ports IN=NetC36_U_SMPS#1_2 OUT=NetC53_U_LDO#1_2 SYNC=NetR24_U_LDO#1_1
U_LDO: designators end in _U_LDO#2; ports IN=NetC36_U_SMPS#2_2 OUT=NetC53_U_LDO#2_2 SYNC=NetR24_U_LDO#2_1

### Notes on the sheet
- (near U12) Check the voltage subtractor
- Single Channel LDO
- Note: no marking of active low signals

### Library data of the parts
C24-C26 C29 C42 C48 C50 C51 C58 C59 = CMP-2007-01136-1: as C4 on sheet Main
C40 C43 C52 = CMP-2007-03234-1: as C2 on sheet MCU & Power
C44 C53 C54 = CMP-2000-07261-1: as C3 on sheet Main; Package / Case: 1206(3216Metric); Thickness (Max): 0.071"(1.80mm); Tolerance: ±10%; Category: Capacitors; Size / Dimension: 0.126"Lx0.063"W(3.20mmx1.60mm); Lead Spacing: -; Standard Package: 1; Applications: GeneralPurpose; Features: -; Package Description: 2-Pin Surface Mount Device, Body 3.2 x 1.6 mm; Package Reference: 1206; Datasheet Version: 07/2015; Lead Style: -; Manufacturer URL: http://www.t-yuden.com/; Mounting Technology: SurfaceMount; Height - Seated (Max): -; Mounting Type: SurfaceMount,MLCC; Datasheet URL: http://datasheet.octopart.com/TMK316B7106KL-TD-Taiyo-Yuden-datasheet-62109620.pdf; Operating Temperature: -55°C~125°C; Series: M; Ratings: -; Packaging: Digi-Reel®; Family: CeramicCapacitors
C55 = T521X476M035ATE030: KEMET - T521X476M035ATE030 - CAP, TANT, POLYMER, 47UF, 35V, CASE X; pin to pad: 1>2 2>1; Tolerance: 20%; ESR (Equivalent Series Resistance): 30mR; Polarity: Polar; Life (Hours): 2000Hour; Dissipation Factor: 10%; Supplier 1: RSComponents; Manufacturer: KEMET; Manufacturer Part Number: T521X476M035ATE030; RoHS: Yes; Category: Polymer Capacitors; Stock 1: 1; Pricing 1: 500=2.79100, 1500=2.59300 (USD); Mount: Surface Mount; Case/Package: 2917; Number of Pins: 2; Case Code (Imperial): 2917; Case Code (Metric): 7343; Min Operating Temperature: -55°C; Max Operating Temperature: 125°C; Capacitance: 47uF; Voltage Rating: 35V; Packaging: Tape and Reel; Package Quantity: 1; Voltage Rating (DC): 35V; Termination: SMD/SMT; Features: General Purpose; Series: KO-CAP T521; Construction: Flat; Length: 7.3mm; Width: 4.3mm; Height: 4mm; Height - Seated (Max): 0.169inch; Depth: 4.3mm; RoHS Compliant: Yes; REACH SVHC: No SVHC; ComponentLink1URL: https://datasheet.ciiva.com/7759/1056102-7759041.pdf?src-supplier=Element14; ComponentLink1Description: https://datasheet.ciiva.com/7759/1056102-7759041.pdf?src-supplier=Element14; ComponentLink2URL: https://datasheet.ciiva.com/262/kem-t2016-t521-262925.pdf?src-supplier=Digi-Key; ComponentLink2Description: https://datasheet.ciiva.com/262/kem-t2016-t521-262925.pdf?src-supplier=Digi-Key; ComponentLink3URL: https://datasheet.ciiva.com/262/kem-t2016-t521-262927.pdf?src-supplier=Digi-Key; ComponentLink3Description: https://datasheet.ciiva.com/262/kem-t2016-t521-262927.pdf?src-supplier=Digi-Key; ComponentLink4URL: https://datasheet.ciiva.com/22698/1899432-22698968.pdf?src-supplier=Element14; ComponentLink4Description: https://datasheet.ciiva.com/22698/1899432-22698968.pdf?src-supplier=Element14; ComponentLink5URL: https://datasheet.ciiva.com/262/kem-t2016-t521-262926.pdf?src-supplier=Digi-Key; ComponentLink5Description: https://datasheet.ciiva.com/262/kem-t2016-t521-262926.pdf?src-supplier=Digi-Key; Supplier Part Number 1: 1447217
C56 = CMP-1665-00014-4: as C1 on sheet Main; Lead Pitch: 5 mm; ComponentLink2URL: http://industrial.panasonic.com/cdbs/www-data/pdf/RDF0000/ABA0000C1038.pdf; DatasheetVersion: 03/2016; ComponentLink1URL: http://www.panasonic.com/; Mount: Through Hole; Max Operating Temperature: 105 degC; Pins: 2; Packaging: Bulk; ComponentLink1Description: Manufacturer URL; Height: 20 mm; REACH SVHC: No SVHC; RoHSCompliant: true; Mounting Technology: Through Hole; PackageDescription: 2-Pin Through Hole Device, Dia 12.5 mm, Body Length 20 mm; Package Quantity: 200; Min Operating Temperature: -55 degC; PackageReference: Radial; ComponentLink2Description: Datasheet; Length: 20 mm
R14 R18 R20 R25 R28 = CMP-2001-00371-1: Manufacturer: Panasonic; Part Number: ERJ-6GEYJ203V
R19 = CMP-1013-00510-2: as R15 on sheet SMPS
R24 = CMP-2001-00420-1: as R16 on sheet SMPS
R27 = CMP-2001-00338-1: Part Number: ERJ-6GEYJ104V; Manufacturer: Panasonic
U10 = DAC80501ZDGSR: pin to pad: 1>5 2>6 3>8 4>7 5>4 6>10 7>2 8>1; Manufacturer: Texas Instruments; Supplier 1: Digi-Key; RoHS: Yes; Stock 1: 1616; Pricing 1: 1=6.15000, 10=5.52700, 25=5.22560, 100=4.52880, 250=4.29656, 500=3.85528, 1000=3.83425 (USD); Supplier Part Number 1: 296-DAC80501ZDGSRCT-ND; Manufacturer Part Number: DAC80501ZDGSR
U11 U12 = CMP-0272-04159-2: Precision, Rail-to-Rail Input/Output, Low Offset Voltage, Low Input Bias Current Op Amp with E-trim, 4.5 to 36 V, -40 to 125 degC, 8-Pin SOIC (D), Green (RoHS & no Sb/Br), Tape and Reel; VS Min: 4.5 V; Channel: 1; Slew Rate: 20 V/us; VS Max: 36 V; Packing: Tape and Reel; ComponentLink3Description: Package Specification; Code_JEDEC: MS-012; PackageVersion: 4040047-3/M, 06/2011; ComponentLink1Description: Manufacturer URL; PartNumber: OPA192IDR; ComponentLink1URL: http://www.ti.com/; ComponentLink2URL: http://www.ti.com/lit/ds/symlink/opa192.pdf; Temperature Max: 125 degC; Temperature Min: -40 degC; Mounting Technology: Surface Mount; RoHS: TRUE; ComponentLink3URL: http://www.ti.com/lit/ml/msoi002j/msoi002j.pdf; PackageDescription: 8-Pin Plastic Small Outline, Body 4.9 x 3.9 mm, Pitch 1.27 mm; DatasheetVersion: SBOS620D; PackageReference: D0008A; ComponentLink2Description: Datasheet
U15 = CMP-0367-00041-2: Low Noise, Very Low Drift, Precision Voltage Reference, -40 to 125 degC, 8-pin SOIC (D), Green (RoHS & no Sb/Br); Manufacturer: Texas Instruments; VO(V): 2.5; Iout/Iz(Max)(mA): 10; Initial Accuracy @ 25/deg C(%): 0.05; VI(Max)(V): 18; Iq(Max)(uA): 1000; Rating: Military; Temp Coeff(Max)(ppm/ degree C): 3; SubFamily: Series Voltage Reference; VI(Min)(V): 2.7; DatasheetVersion: SBOS410E; Eco-Plan: Green (RoHS & no Sb/Br); ComponentLink2URL: http://www.ti.com/general/docs/lit/getliterature.tsp?genericPartNumber=REF5025&fileType=pdf; PackageVersion: 4040047-3/M; PackageDescription: 8-Pin Plastic Small Outline, Body 4.9 x 3.9 mm, Pitch 1.27 mm; PartNumber: REF5025AIDR; ComponentLink3Description: Package Specification; ComponentLink1URL: http://www.ti.com/; ComponentLink1Description: Manufacturer URL; PackageReference: D0008A; ComponentLink3URL: http://www.ti.com/litv/pdf/msoi002j; Mounting Technology: Surface Mount; ComponentLink2Description: Datasheet; Code_JEDEC: MS-012
U16 = CMP-0062-02529-3: 5A Low Dropout Positive Regulators, 3-pin TO-220, Pb-Free; Manufacturer: Texas Instruments; CompType: LDO IC; PackageTopMarking: NSUZXYTTE#*LM1084*IT-ADJ; PowerWise: N; ComponentLink1Description: Datasheet URL; ComponentLink1URL: http://www.ti.com/general/docs/lit/getliterature.tsp?genericPartNumber=LM1084&fileType=pdf; PackageDescription: TO-220, Molded, 3 Lead, Straight; PinCount: 3; PackageReference: NDE0003A; RoHS: Y

## Sheet Sensing.SchDoc
size A4; SheetNumber: 4; SheetTotal: 5
Used 2 times, as channels U_Sensing, U_Sensing. Parts and nets are listed once, with the designators drawn on the sheet.
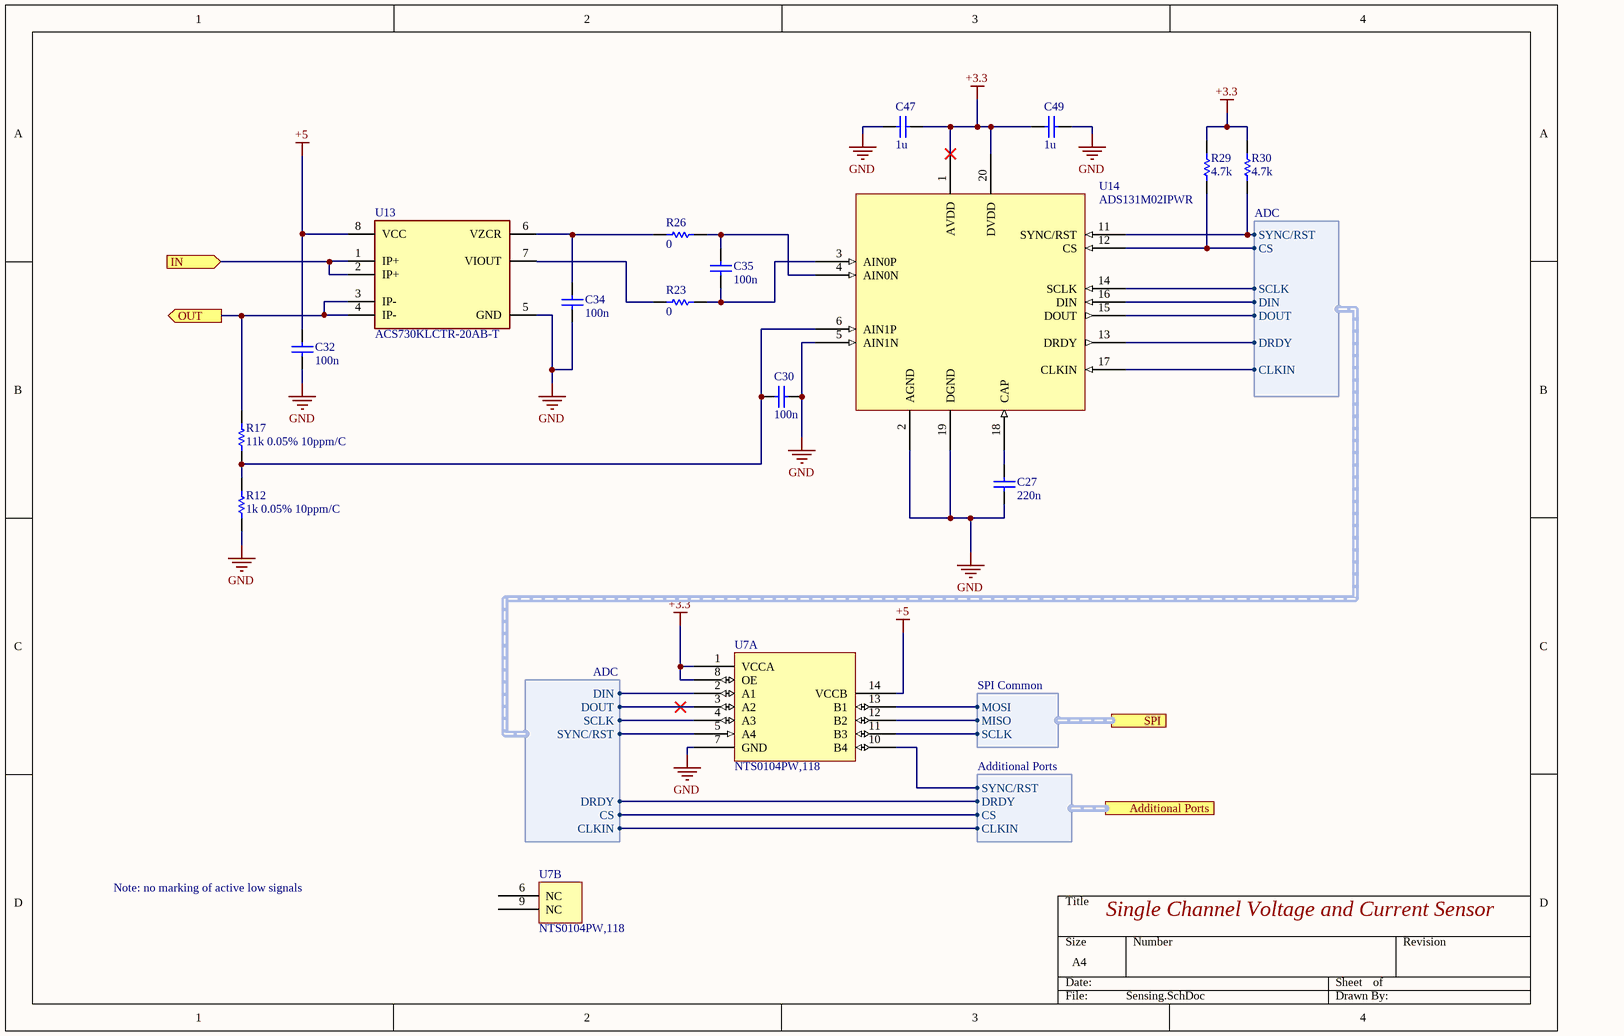
[diagram p4: Sensing.SchDoc]

### Parts
C27  220n  [CAPC2013X140X50NL20T25]
C30  100n  [CAPC2013X145X50NL20T25]
C32  100n  [CAPC2013X145X50LL20T25]
C34  100n  [CAPC2013X145X50LL20T25]
C35  100n  [CAPC2013X145X50LL20T25]
C47  1u  [CAPC2013X140X50LL20T25]
C49  1u  [CAPC2013X140X50LL20T25]
R12  1k 0.05% 10ppm/C  [RESC2013X55X40NL15T20]
R17  11k 0.05% 10ppm/C  [RESC2013X55X40NL15T20]
R23  0  [RESC2013X70X40NL20T20]
R26  0  [RESC2013X70X40NL20T20]
R29  4.7k  [RESC2013X70X40NL20T20]
R30  4.7k  [RESC2013X70X40NL20T20]
U7  NTS0104PW,118  [TSOP65P640X110-14N]  (parts A,B of 2)
U13  ACS730KLCTR-20AB-T  [FP-LC-8-IPC_B]
U14  ADS131M02IPWR  [TSOP65P640X120-20N]

### Ports
Additional Ports (harness Additional Ports), IN (in), OUT (out), SPI (harness SPI Common)

### Harnesses
ADC: SYNC/RST, CS, SCLK, DIN, DOUT, DRDY, CLKIN
ADC: CLKIN, CS, DIN, DOUT, DRDY, SCLK, SYNC/RST
Additional Ports: SYNC/RST, DRDY, CS, CLKIN
SPI Common: MISO, MOSI, SCLK

### Nets
+3.3: C47.1 C49.1 R29.2 R30.2 U7.1(VCCA) U7.8(OE) U14.1(AVDD) U14.20(DVDD)
+5: C32.1 U7.14(VCCB) U13.8(VCC)
GND: C27.1 C30.2 C32.2 C34.2 C47.2 C49.2 R12.1 U7.7(GND) U13.5(GND) U14.2(AGND) U14.5(AIN1N) U14.19(DGND)
IN: U13.1(IP+) U13.2(IP+) ; port IN
OUT: R17.2 U13.3(IP-) U13.4(IP-) ; port OUT
NetC27_2: C27.2 U14.18(CAP)
NetC30_1: C30.1 R12.2 R17.1 U14.6(AIN1P)
NetC34_1: C34.1 R26.2 U13.6(VZCR)
NetC35_1: C35.1 R26.1 U14.4(AIN0N)
NetC35_2: C35.2 R23.1 U14.3(AIN0P)
NetR23_2: R23.2 U13.7(VIOUT)
NetR29_1: R29.1 U14.12(CS) ; harness ADC.CS, port Additional Ports.CS
NetR30_1: R30.1 U7.5(A4) U14.11(SYNC/RST) ; harness ADC.SYNC/RST
NetU7_2: U7.2(A1) U14.16(DIN) ; harness ADC.DIN
NetU7_3: U7.3(A2) U14.15(DOUT) ; harness ADC.DOUT
NetU7_4: U7.4(A3) U14.14(SCLK) ; harness ADC.SCLK
NetU7_10: U7.10(B4) ; port Additional Ports.SYNC/RST
NetU7_11: U7.11(B3) ; port SPI.SCLK
NetU7_12: U7.12(B2) ; port SPI.MISO
NetU7_13: U7.13(B1) ; port SPI.MOSI
NetU14_13: U14.13(DRDY) ; harness ADC.DRDY, port Additional Ports.DRDY
NetU14_17: U14.17(CLKIN) ; harness ADC.CLKIN, port Additional Ports.CLKIN

Not connected (* = marked no-connect by the designer): U7 6(NC) 9(NC)

### Channels
U_Sensing: designators end in _U_Sensing#1; ports IN=NetC53_U_LDO#1_2 OUT=NetJ4_1
U_Sensing: designators end in _U_Sensing#2; ports IN=NetC53_U_LDO#2_2 OUT=NetJ3_1

### Notes on the sheet
- Note: no marking of active low signals
- Single Channel Voltage and Current Sensor

### Library data of the parts
C27 = CMP-2007-04602-1: Manufacturer: AVX Interconnect / Elco; Part Number: 08053C224JAT2A
C30 C32 C34 C35 = CMP-2007-01136-1: as C4 on sheet Main
C47 C49 = CMP-2007-03234-1: as C2 on sheet MCU & Power
R12 = ERA6ARW102V: RES SMD 1K OHM 0.05% 1/8W 0805; Manufacturer: Panasonic; Resistance: 1kR; Power Rating: 125mW; Voltage Rating: 200V; Temperature Coefficient: 10ppm/°C; Voltage Rating (DC): 100V; Supplier 1: Digi-Key; Supplier Part Number 1: P1.0KBSCT-ND; Manufacturer Part Number: ERA6ARW102V; RoHS: Yes; Category: Chip SMD Resistors; Stock 1: 6885; Pricing 1: 1=0.74000, 10=0.61500, 100=0.41270, 1000=0.24145, 2500=0.23882 (USD); Mount: Surface Mount; Case/Package: 0805; Number of Pins: 2; Case Code (Metric): 2012; Case Code (Imperial): 0805; Weight: 0.000194oz; Contact Plating: Tin; Min Operating Temperature: -55°C; Max Operating Temperature: 155°C; Packaging: Tape and Reel; Tolerance: 0.05%; Package Quantity: 1; Resistor Type: Thin Film; Number of Terminations: 2; Termination: SMD/SMT; Max Power Dissipation: 125mW; Features: Automotive AEC-Q200; Series: ERA-6A; Construction: Rectangular; Resistance Tolerance: 0.05%; Length: 2mm; Width: 0.049inch; Height: 0.024inch; Depth: 1.25mm; Radiation Hardening: No; REACH SVHC: No SVHC; Military Standard: Not; Lead Free: Lead Free; RoHS Compliant: Yes; ComponentLink1URL: https://datasheet.ciiva.com/9117/aoa0000ce26-9117942.pdf?src-supplier=Avnet; ComponentLink1Description: https://datasheet.ciiva.com/9117/aoa0000ce26-9117942.pdf?src-supplier=Avnet; ComponentLink2URL: https://datasheet.ciiva.com/17215/aoa0000ce26-17215289.pdf?src-supplier=Avnet+Europe; ComponentLink2Description: https://datasheet.ciiva.com/17215/aoa0000ce26-17215289.pdf?src-supplier=Avnet+Europe
R17 = ERA6ARW113V: Res Thin Film 0805 11K Ohm 0.05% 1/8W 10ppm/C Molded SMD Punched Carrier T/R; Manufacturer: Panasonic; Resistance: 11kR; Power Rating: 125mW; Voltage Rating: 200V; Temperature Coefficient: 10ppm/°C; Supplier 1: Digi-Key; Supplier Part Number 1: P11KBSCT-ND; Manufacturer Part Number: ERA6ARW113V; RoHS: Yes; Category: Chip SMD Resistors; Stock 1: 1039; Pricing 1: 1=0.74000, 10=0.61500, 100=0.41270, 1000=0.24145, 2500=0.23882 (USD); Mount: Surface Mount; Case/Package: 0805; Case Code (Metric): 2012; Case Code (Imperial): 0805; Contact Plating: Tin; Min Operating Temperature: -55°C; Max Operating Temperature: 155°C; Package Quantity: 1; Packaging: Tape and Reel; Tolerance: 0.05%; Resistor Type: Thin Film,Metal Film; Number of Terminations: 2; Max Power Dissipation: 125mW; Features: Automotive AEC-Q200; Series: ERA-6A; Length: 0.079inch; Width: 0.049inch; Height: 0.024inch; Depth: 1.25mm; Radiation Hardening: No; Lead Free: Lead Free; RoHS Compliant: Yes; ComponentLink1URL: https://datasheet.ciiva.com/9193/aoa0000ce26-9193943.pdf?src-supplier=Avnet; ComponentLink1Description: https://datasheet.ciiva.com/9193/aoa0000ce26-9193943.pdf?src-supplier=Avnet; ComponentLink2URL: https://datasheet.ciiva.com/24042/aoa0000ce26-197354-24042121.pdf?src-supplier=Mouser; ComponentLink2Description: https://datasheet.ciiva.com/24042/aoa0000ce26-197354-24042121.pdf?src-supplier=Mouser; ComponentLink3URL: https://datasheet.ciiva.com/17211/aoa0000ce26-17211916.pdf?src-supplier=Avnet+Europe; ComponentLink3Description: https://datasheet.ciiva.com/17211/aoa0000ce26-17211916.pdf?src-supplier=Avnet+Europe
R23 R26 = CMP-1665-00002-5: as R11 on sheet SMPS; REACH SVHC: No SVHC; Min Operating Temperature: -55 degC; Case/Package: 0805; Packaging: Tape and Reel; Package Quantity: 5000; ComponentLink1Description: Manufacturer URL; PackageDescription: 2-Pin Surface Mount Device, Body 2 x 1.25 mm; Mounting Technology: Surface Mount; Max Operating Temperature: 155 degC; Width: 1.25 mm; RoHSCompliant: True; Height: 0.6 mm; ComponentLink1URL: http://www.panasonic.com/; ComponentLink2URL: http://industrial.panasonic.com/cdbs/www-data/pdf/RDA0000/AOA0000C84.pdf; Case Code (Imperial): 0805; DatasheetVersion: 03/2015; Length: 2 mm; Case Code (Metric): 2012; ComponentLink2Description: Datasheet; Radiation Hardening: No
R29 R30 = CMP-2001-00420-1: as R16 on sheet SMPS
U7 = NTS0104PW,118: as U2 on sheet MCU & Power; Supplier 1: Digi-Key; RoHS: Yes; Category: Voltage Level Shifters; Stock 1: 15992; Pricing 1: 1=0.89000, 10=0.79100, 25=0.75120, 100=0.72820 (USD); Mount: Surface Mount; Case/Package: TSSOP; Number of Pins: 14; Min Operating Temperature: -40°C; Max Operating Temperature: 125°C; Logic Function: Translator; Packaging: Tape and Reel; Package Quantity: 1; Number of Bits: 4; Output Type: Voltage; Series: -; Radiation Hardening: No; RoHS Compliant: Yes; Lead Free: Lead Free; ComponentLink1URL: https://datasheet.ciiva.com/15096/getdatasheetpartid-507519-15096327.pdf?src-supplier=Verical; ComponentLink1Description: https://datasheet.ciiva.com/15096/getdatasheetpartid-507519-15096327.pdf?src-supplier=Verical; ComponentLink2URL: https://datasheet.ciiva.com/1899/nts0104-1899064.pdf?src-supplier=Digi-Key; ComponentLink2Description: https://datasheet.ciiva.com/1899/nts0104-1899064.pdf?src-supplier=Digi-Key; ComponentLink3URL: https://datasheet.ciiva.com/1899/nts0104-1899065.pdf?src-supplier=Digi-Key; ComponentLink3Description: https://datasheet.ciiva.com/1899/nts0104-1899065.pdf?src-supplier=Digi-Key; ComponentLink4URL: https://datasheet.ciiva.com/1899/nts0104-1899066.pdf?src-supplier=Digi-Key; ComponentLink4Description: https://datasheet.ciiva.com/1899/nts0104-1899066.pdf?src-supplier=Digi-Key; ComponentLink5URL: https://datasheet.ciiva.com/8244/nts0104-8244175.pdf?src-supplier=Avnet; ComponentLink5Description: https://datasheet.ciiva.com/8244/nts0104-8244175.pdf?src-supplier=Avnet; Manufacturer Part Number: NTS0104PW,118
U13 = CMP-82923-000147-1: 1MHZ BANDWIDTH INTEGRATED, HALL; Linearity: 0.75%; Polarity: Bidirectional; Number of Channels: 1; Max Supply Current: 25mA; Response Time: 700ns; Sensitivity: 100mV/A; Current Sensing: 20A; Accuracy: 3%; Frequency: 1MHz; Case/Package: SOIC; Packaging: Cut Tape; Min Operating Temperature: -40°C; RoHS Compliant: Yes; Mount: Surface Mount; Number of Pins: 8; Max Operating Temperature: 125°C
U14 = ADS131M02IPWR: Digital to Analog Converter; Manufacturer: Texas Instruments; Supplier 1: Mouser; RoHS: No; Stock 1: 1885; Pricing 1: 1=3.34000, 10=3.01000, 50=2.84000, 100=2.46000, 1000=1.79000, 10000=1.66000 (USD); Manufacturer Part Number: ADS131M02IPWR